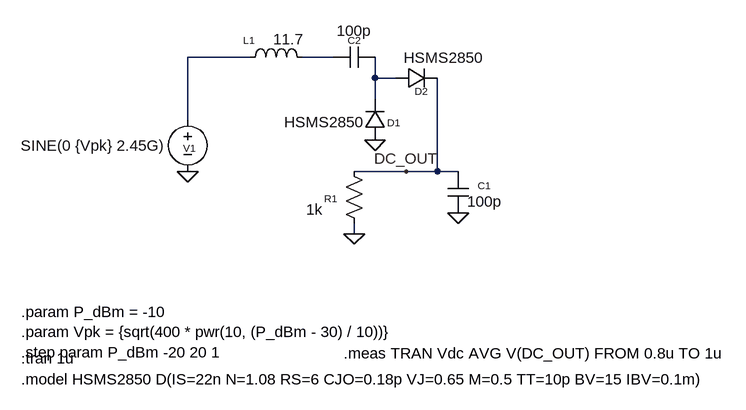
[diagram p0: schematic Voltage_Doubler_rectifier_sim.asc]
Voltage_Doubler_rectifier_sim.asc, the LTspice schematic file:
Version 4
SHEET 1 948 720
WIRE 144 208 48 208
WIRE 272 208 224 208
WIRE 336 240 336 208
WIRE 368 240 336 240
WIRE 336 272 336 240
WIRE 48 304 48 208
WIRE 384 384 304 384
WIRE 432 384 432 240
WIRE 432 384 384 384
WIRE 464 384 432 384
WIRE 304 480 304 464
FLAG 48 384 0
FLAG 304 480 0
FLAG 464 448 0
FLAG 336 336 0
FLAG 384 384 DC_OUT
SYMBOL voltage 48 288 R0
WINDOW 0 -7 60 Left 1
WINDOW 3 -257 56 Left 2
SYMATTR InstName V1
SYMATTR Value SINE(0 {Vpk} 2.45G)
SYMATTR SpiceLine Rser=50
SYMBOL Cap 448 384 R0
WINDOW 0 46 22 Left 1
WINDOW 3 30 46 Left 2
SYMATTR InstName C1
SYMATTR Value 100p
SYMBOL Res 288 368 R0
WINDOW 0 -30 58 Left 1
WINDOW 3 -58 75 Left 2
SYMATTR InstName R1
SYMATTR Value 1k
SYMBOL ind 128 224 R270
WINDOW 0 32 14 VTop 1
WINDOW 3 59 75 VBottom 2
SYMATTR InstName L1
SYMATTR Value 11.7
SYMBOL Cap 336 192 R90
WINDOW 0 0 32 VBottom 1
WINDOW 3 -40 32 VTop 2
SYMATTR InstName C2
SYMATTR Value 100p
SYMBOL Diode 352 336 R180
WINDOW 0 -23 27 Left 1
WINDOW 3 33 28 Left 2
SYMATTR InstName D1
SYMATTR Value HSMS2850
SYMBOL Diode 368 256 R270
WINDOW 0 -15 39 VTop 1
WINDOW 3 63 74 VBottom 2
SYMATTR InstName D2
SYMATTR Value HSMS2850
TEXT -208 704 Left 2 !.model HSMS2850 D(IS=22n N=1.08 RS=6 CJO=0.18p VJ=0.65 M=0.5 TT=10p BV=15 IBV=0.1m)
TEXT -208 672 Left 2 !.tran 1u
TEXT -208 600 Left 2 !.param P_dBm = -10\n.param Vpk = {sqrt(400 * pwr(10, (P_dBm - 30) / 10))}\n.step param P_dBm -20 20 1
TEXT 288 664 Left 2 !.meas TRAN Vdc AVG V(DC_OUT) FROM 0.8u TO 1u

The netlist it stands for:
* Voltage_Doubler_rectifier_sim.asc
V1 N001 0 SINE(0 {Vpk} 2.45G) Rser=50
C1 DC_OUT 0 100p
R1 DC_OUT 0 1k
L1 N001 N002 11.7
C2 N003 N002 100p
D1 0 N003 HSMS2850
D2 N003 DC_OUT HSMS2850
.model D D
.lib standard.dio
.model HSMS2850 D(IS=22n N=1.08 RS=6 CJO=0.18p VJ=0.65 M=0.5 TT=10p BV=15 IBV=0.1m)
.tran 1u
.param P_dBm = -10
.param Vpk = {sqrt(400 * pwr(10, (P_dBm - 30) / 10))}
.step param P_dBm -20 20 1
.meas TRAN Vdc AVG V(DC_OUT) FROM 0.8u TO 1u
.backanno
.end